# Altium schematic sheet 7seg.SchDoc
size A3; SheetNumber: 3; SheetTotal: 8
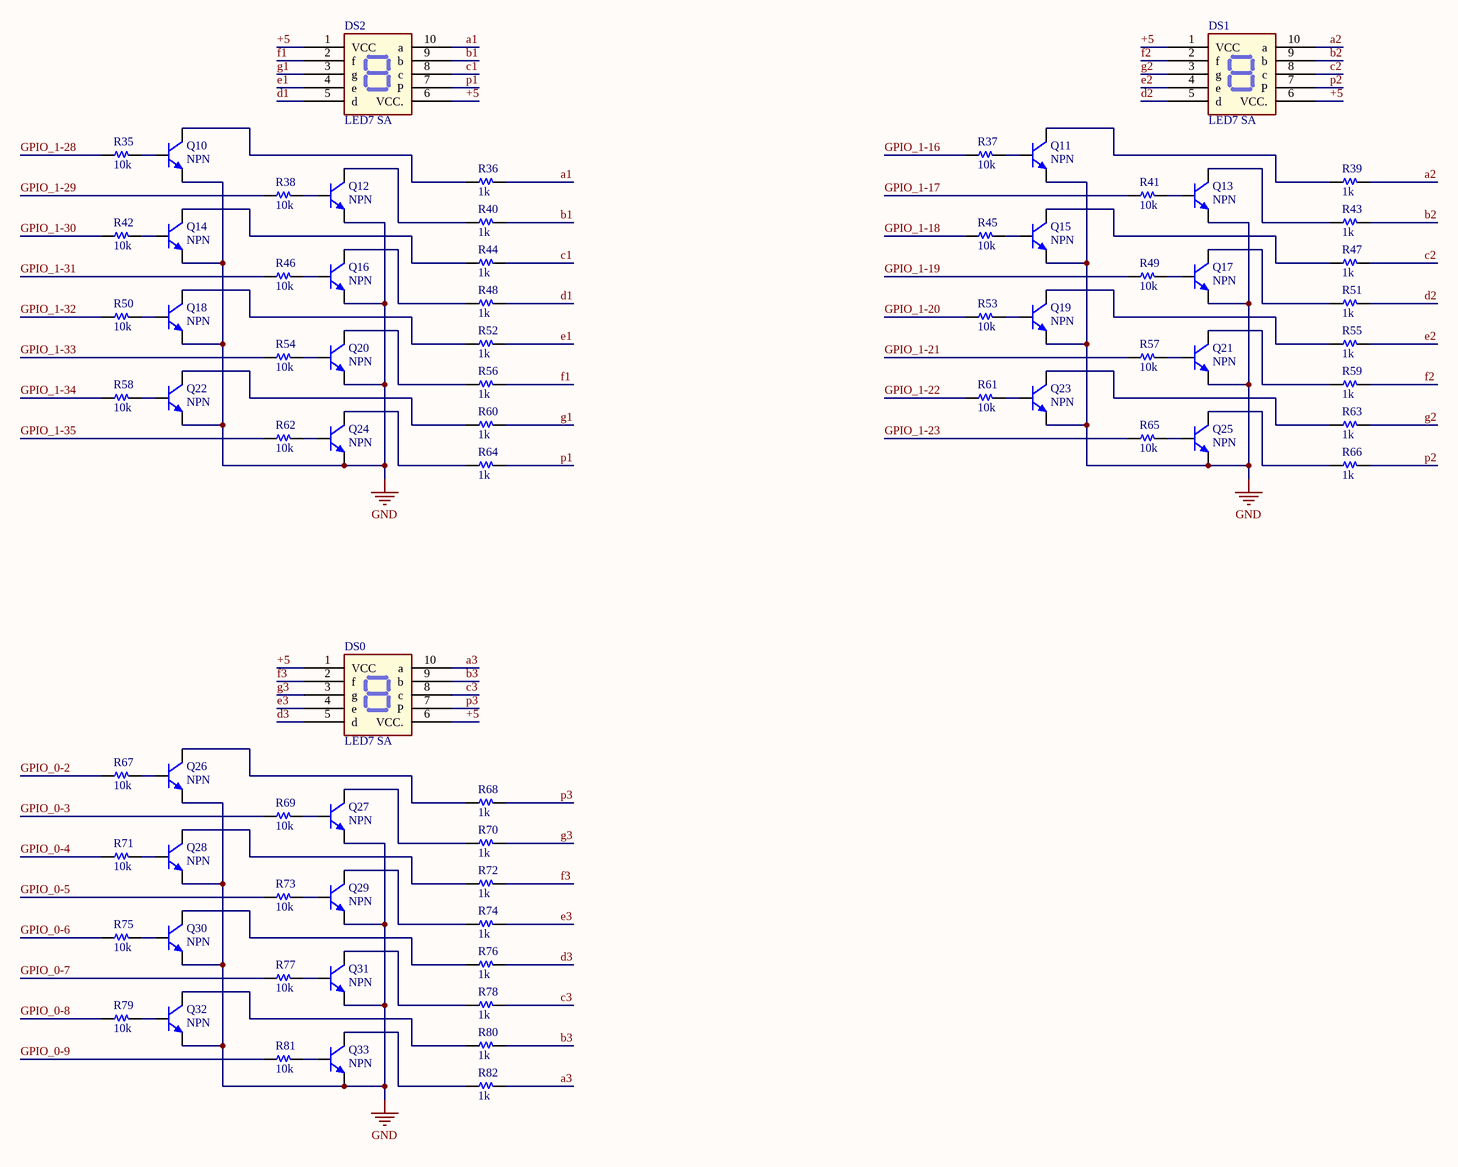
[diagram p0: 7seg.SchDoc]

## Parts
DS0  LED7 SA  [Led7seg 0.36in]
DS1  LED7 SA  [Led7seg 0.36in]
DS2  LED7 SA  [Led7seg 0.36in]
Q10  NPN  [SOT-23]
Q11  NPN  [SOT-23]
Q12  NPN  [SOT-23]
Q13  NPN  [SOT-23]
Q14  NPN  [SOT-23]
Q15  NPN  [SOT-23]
Q16  NPN  [SOT-23]
Q17  NPN  [SOT-23]
Q18  NPN  [SOT-23]
Q19  NPN  [SOT-23]
Q20  NPN  [SOT-23]
Q21  NPN  [SOT-23]
Q22  NPN  [SOT-23]
Q23  NPN  [SOT-23]
Q24  NPN  [SOT-23]
Q25  NPN  [SOT-23]
Q26  NPN  [SOT-23]
Q27  NPN  [SOT-23]
Q28  NPN  [SOT-23]
Q29  NPN  [SOT-23]
Q30  NPN  [SOT-23]
Q31  NPN  [SOT-23]
Q32  NPN  [SOT-23]
Q33  NPN  [SOT-23]
R35  10k  [R 0603]
R36  1k  [R 0603]
R37  10k  [R 0603]
R38  10k  [R 0603]
R39  1k  [R 0603]
R40  1k  [R 0603]
R41  10k  [R 0603]
R42  10k  [R 0603]
R43  1k  [R 0603]
R44  1k  [R 0603]
R45  10k  [R 0603]
R46  10k  [R 0603]
R47  1k  [R 0603]
R48  1k  [R 0603]
R49  10k  [R 0603]
R50  10k  [R 0603]
R51  1k  [R 0603]
R52  1k  [R 0603]
R53  10k  [R 0603]
R54  10k  [R 0603]
R55  1k  [R 0603]
R56  1k  [R 0603]
R57  10k  [R 0603]
R58  10k  [R 0603]
R59  1k  [R 0603]
R60  1k  [R 0603]
R61  10k  [R 0603]
R62  10k  [R 0603]
R63  1k  [R 0603]
R64  1k  [R 0603]
R65  10k  [R 0603]
R66  1k  [R 0603]
R67  10k  [R 0603]
R68  1k  [R 0603]
R69  10k  [R 0603]
R70  1k  [R 0603]
R71  10k  [R 0603]
R72  1k  [R 0603]
R73  10k  [R 0603]
R74  1k  [R 0603]
R75  10k  [R 0603]
R76  1k  [R 0603]
R77  10k  [R 0603]
R78  1k  [R 0603]
R79  10k  [R 0603]
R80  1k  [R 0603]
R81  10k  [R 0603]
R82  1k  [R 0603]

## Nets
GND: Q10.2(E) Q11.2(E) Q12.2(E) Q13.2(E) Q14.2(E) Q15.2(E) Q16.2(E) Q17.2(E) Q18.2(E) Q19.2(E) Q20.2(E) Q21.2(E) Q22.2(E) Q23.2(E) Q24.2(E) Q25.2(E) Q26.2(E) Q27.2(E) Q28.2(E) Q29.2(E) Q30.2(E) Q31.2(E) Q32.2(E) Q33.2(E)
+5: DS0.1(VCC) DS0.6(VCC.) DS1.1(VCC) DS1.6(VCC.) DS2.1(VCC) DS2.6(VCC.)
a1: DS2.10(a) R36.2
a2: DS1.10(a) R39.2
a3: DS0.10(a) R82.2
b1: DS2.9(b) R40.2
b2: DS1.9(b) R43.2
b3: DS0.9(b) R80.2
c1: DS2.8(c) R44.2
c2: DS1.8(c) R47.2
c3: DS0.8(c) R78.2
d1: DS2.5(d) R48.2
d2: DS1.5(d) R51.2
d3: DS0.5(d) R76.2
e1: DS2.4(e) R52.2
e2: DS1.4(e) R55.2
e3: DS0.4(e) R74.2
f1: DS2.2(f) R56.2
f2: DS1.2(f) R59.2
f3: DS0.2(f) R72.2
g1: DS2.3(g) R60.2
g2: DS1.3(g) R63.2
g3: DS0.3(g) R70.2
GPIO_0-2: R67.1
GPIO_0-3: R69.1
GPIO_0-4: R71.1
GPIO_0-5: R73.1
GPIO_0-6: R75.1
GPIO_0-7: R77.1
GPIO_0-8: R79.1
GPIO_0-9: R81.1
GPIO_1-16: R37.1
GPIO_1-17: R41.1
GPIO_1-18: R45.1
GPIO_1-19: R49.1
GPIO_1-20: R53.1
GPIO_1-21: R57.1
GPIO_1-22: R61.1
GPIO_1-23: R65.1
GPIO_1-28: R35.1
GPIO_1-29: R38.1
GPIO_1-30: R42.1
GPIO_1-31: R46.1
GPIO_1-32: R50.1
GPIO_1-33: R54.1
GPIO_1-34: R58.1
GPIO_1-35: R62.1
p1: DS2.7(P) R64.2
p2: DS1.7(P) R66.2
p3: DS0.7(P) R68.2
NetQ10_1: Q10.1(B) R35.2
NetQ10_3: Q10.3(C) R36.1
NetQ11_1: Q11.1(B) R37.2
NetQ11_3: Q11.3(C) R39.1
NetQ12_1: Q12.1(B) R38.2
NetQ12_3: Q12.3(C) R40.1
NetQ13_1: Q13.1(B) R41.2
NetQ13_3: Q13.3(C) R43.1
NetQ14_1: Q14.1(B) R42.2
NetQ14_3: Q14.3(C) R44.1
NetQ15_1: Q15.1(B) R45.2
NetQ15_3: Q15.3(C) R47.1
NetQ16_1: Q16.1(B) R46.2
NetQ16_3: Q16.3(C) R48.1
NetQ17_1: Q17.1(B) R49.2
NetQ17_3: Q17.3(C) R51.1
NetQ18_1: Q18.1(B) R50.2
NetQ18_3: Q18.3(C) R52.1
NetQ19_1: Q19.1(B) R53.2
NetQ19_3: Q19.3(C) R55.1
NetQ20_1: Q20.1(B) R54.2
NetQ20_3: Q20.3(C) R56.1
NetQ21_1: Q21.1(B) R57.2
NetQ21_3: Q21.3(C) R59.1
NetQ22_1: Q22.1(B) R58.2
NetQ22_3: Q22.3(C) R60.1
NetQ23_1: Q23.1(B) R61.2
NetQ23_3: Q23.3(C) R63.1
NetQ24_1: Q24.1(B) R62.2
NetQ24_3: Q24.3(C) R64.1
NetQ25_1: Q25.1(B) R65.2
NetQ25_3: Q25.3(C) R66.1
NetQ26_1: Q26.1(B) R67.2
NetQ26_3: Q26.3(C) R68.1
NetQ27_1: Q27.1(B) R69.2
NetQ27_3: Q27.3(C) R70.1
NetQ28_1: Q28.1(B) R71.2
NetQ28_3: Q28.3(C) R72.1
NetQ29_1: Q29.1(B) R73.2
NetQ29_3: Q29.3(C) R74.1
NetQ30_1: Q30.1(B) R75.2
NetQ30_3: Q30.3(C) R76.1
NetQ31_1: Q31.1(B) R77.2
NetQ31_3: Q31.3(C) R78.1
NetQ32_1: Q32.1(B) R79.2
NetQ32_3: Q32.3(C) R80.1
NetQ33_1: Q33.1(B) R81.2
NetQ33_3: Q33.3(C) R82.1

## Library data of the parts
Q10-Q33 = Transistor NPN: NPN Bipolar Transistor
R35-R82 = Resistor